# EAGLE design pinoccio-test (EAGLE 6.2)
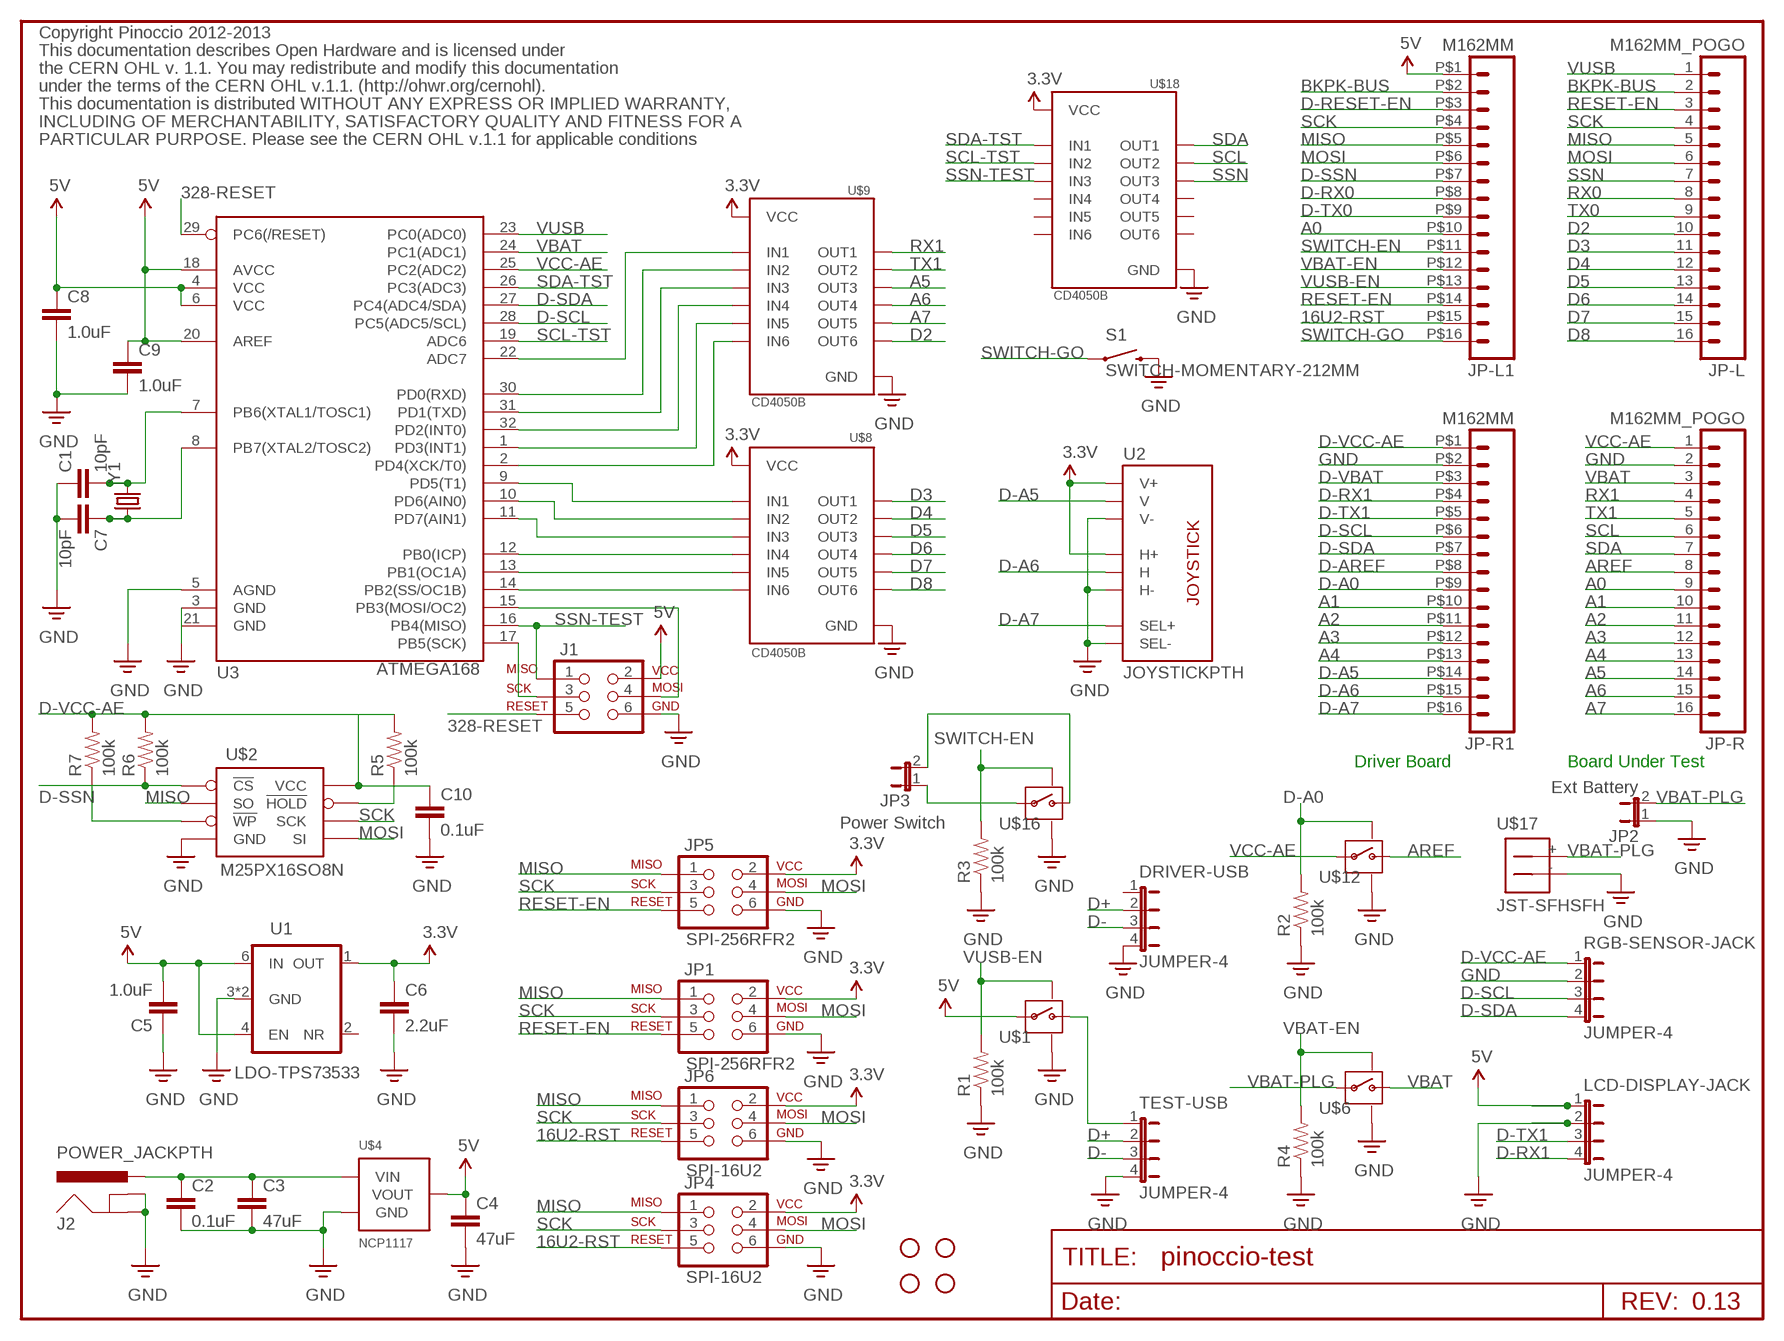
[diagram p0: schematic, sheet 1]

## Parts
C1  10pF  CAP0402-CAP  [0402-CAP]
C2  0.1uF  CAP0402-CAP  [0402-CAP]
C3  47uF  CAP0805  [0805]
C4  47uF  CAP0805  [0805]
C5  1.0uF  CAP0402-CAP  [0402-CAP]
C6  2.2uF  CAP0402-CAP  [0402-CAP]
C7  10pF  CAP0402-CAP  [0402-CAP]
C8  1.0uF  CAP0402-CAP  [0402-CAP]
C9  1.0uF  CAP0402-CAP  [0402-CAP]
C10  0.1uF  CAP0402-CAP  [0402-CAP]
DRIVER-USB  JUMPER-4  [1X04]
J1  SPI-328P  AVR_SPI_PRG_6PTH  [2X3]
J2  POWER_JACKPTH  [POWER_JACK_PTH]
JP1  SPI-256RFR2  AVR_SPI_PRG_6PTH  [2X3]
JP2  Ext Battery  JUMPER-2PTH  [1X02]
JP3  Power Switch  JUMPER-2PTH  [1X02]
JP4  SPI-16U2  AVR_SPI_PRG_6PTH  [2X3]
JP5  SPI-256RFR2  AVR_SPI_PRG_6PTH  [2X3]
JP6  SPI-16U2  AVR_SPI_PRG_6PTH  [2X3]
JP7  STAND-OFF  [STAND-OFF]
JP9  STAND-OFF  [STAND-OFF]
JP10  STAND-OFF  [STAND-OFF]
JP12  STAND-OFF  [STAND-OFF]
JP-L  M162MM_POGO  [1X16_2MM_POGO]
JP-L1  M162MM  [1X16_2MM]
JP-R  M162MM_POGO  [1X16_2MM_POGO]
JP-R1  M162MM  [1X16_2MM]
LCD-DISPLAY-JACK  JUMPER-4  [1X04]
R1  100k  RESISTOR0402-RES  [0402-RES]
R2  100k  RESISTOR0402-RES  [0402-RES]
R3  100k  RESISTOR0402-RES  [0402-RES]
R4  100k  RESISTOR0402-RES  [0402-RES]
R5  100k  RESISTOR0402-RES  [0402-RES]
R6  100k  RESISTOR0402-RES  [0402-RES]
R7  100k  RESISTOR0402-RES  [0402-RES]
RGB-SENSOR-JACK  JUMPER-4  [1X04]
S1  SWITCH-MOMENTARY-212MM  [TACTILE-PTH-12MM]
TEST-USB  JUMPER-4  [1X04]
U1  LDO-TPS73533  [SON-6-DRV]
U2  JOYSTICKPTH  [JOYSTICK]
U3  ATMEGA168  [TQFP32-08]
U$1  SWITCH-MOSFETTDFN4  [TDFN4]
U$2  M25PX16SO8N  [SO8N]
U$4  NCP1117  [SOT223]
U$6  SWITCH-MOSFETTDFN4  [TDFN4]
U$8  CD4050B  [TSSOP-16]
U$9  CD4050B  [TSSOP-16]
U$12  SWITCH-MOSFETTDFN4  [TDFN4]
U$16  SWITCH-MOSFETTDFN4  [TDFN4]
U$17  JST-SFHSFH  [JST-SFH]
U$18  CD4050B  [TSSOP-16]
Y1  CRYSTALABM10  [CRYSTAL-SMD-2.5X2-ABM10]

## Nets
3.3V: C6.1 JP1.2 JP4.2 JP5.2 JP6.2 U1.1(OUT) U2.H1(H+) U2.V1(V+) U$8.1(VCC) U$9.1(VCC) U$18.1(VCC)
5V: C4.1 C5.2 C8.1 C9.1 J1.2 JP-L1.P$1 LCD-DISPLAY-JACK.1 U1.4(EN) U1.6(IN) U3.4(VCC) U3.6(VCC) U3.18(AVCC) U3.20(AREF) U$1.P$3(IN) U$4.2(VOUT) U$4.4(VOUT)
16U2-RST: JP4.5 JP6.5 JP-L1.P$15
328-RESET: J1.5 U3.29(PC6(/RESET))
A0: JP-L1.P$10 JP-R.9
A1: JP-R1.P$10 JP-R.10
A2: JP-R1.P$11 JP-R.11
A3: JP-R1.P$12 JP-R.12
A4: JP-R1.P$13 JP-R.13
A5: JP-R.14 U$9.6(OUT3)
A6: JP-R.15 U$9.10(OUT4)
A7: JP-R.16 U$9.12(OUT5)
AREF: JP-R.8 U$12.P$1(OUT)
BKPK-BUS: JP-L1.P$2 JP-L.2
D2: JP-L.10 U$9.15(OUT6)
D3: JP-L.11 U$8.2(OUT1)
D4: JP-L.12 U$8.4(OUT2)
D5: JP-L.13 U$8.6(OUT3)
D6: JP-L.14 U$8.10(OUT4)
D7: JP-L.15 U$8.12(OUT5)
D8: JP-L.16 U$8.15(OUT6)
D+: DRIVER-USB.2 TEST-USB.2
D-: DRIVER-USB.3 TEST-USB.3
D-A0: JP-R1.P$9 R2.2 U$12.P$4(ON)
D-A5: JP-R1.P$14 U2.V2(V)
D-A6: JP-R1.P$15 U2.H2(H)
D-A7: JP-R1.P$16 U2.B1A(SEL+)
D-AREF: JP-R1.P$8
D-RESET-EN: JP-L1.P$3
D-RX0: JP-L1.P$8
D-RX1: JP-R1.P$4 LCD-DISPLAY-JACK.4
D-SCL: JP-R1.P$6 RGB-SENSOR-JACK.3 U3.28(PC5(ADC5/SCL))
D-SDA: JP-R1.P$7 RGB-SENSOR-JACK.4 U3.27(PC4(ADC4/SDA))
D-SSN: JP-L1.P$7 R6.1 U$2.1(!CS)
D-TX0: JP-L1.P$9
D-TX1: JP-R1.P$5 LCD-DISPLAY-JACK.3
D-VBAT: JP-R1.P$3
D-VCC-AE: C10.1 JP-R1.P$1 R5.2 R6.2 R7.2 RGB-SENSOR-JACK.1 U$2.8(VCC)
GND: C1.1 C2.2 C3.2 C4.2 C5.1 C6.2 C7.2 C8.2 C9.2 C10.2 DRIVER-USB.4 J1.6 J2.GND J2.GNDBREAK JP1.6 JP2.1 JP4.6 JP5.6 JP6.6 JP-R1.P$2 JP-R.2 LCD-DISPLAY-JACK.2 R1.1 R2.1 R3.1 R4.1 RGB-SENSOR-JACK.2 S1.3 TEST-USB.4 U1.3(GND) U1.PAD(GND) U2.B2A(SEL-) U2.H3(H-) U2.V3(V-) U3.3(GND) U3.5(AGND) U$1.P$2(GND) U$1.P$5(GND) U$2.4(GND) U$4.1(GND) U$6.P$2(GND) U$6.P$5(GND) U$8.8(GND) U$9.8(GND) U$12.P$2(GND) U$12.P$5(GND) U$16.P$2(GND) U$16.P$5(GND) U$17.- U$18.8(GND)
MISO: JP1.1 JP4.1 JP5.1 JP6.1 JP-L1.P$5 JP-L.5 U$2.2(SO)
MOSI: JP1.4 JP4.4 JP5.4 JP6.4 JP-L1.P$6 JP-L.6 U$2.5(SI)
N$1: U3.2(PD4(XCK/T0)) U$9.14(IN6)
N$2: U3.1(PD3(INT1)) U$9.11(IN5)
N$3: U3.14(PB2(SS/OC1B)) U$8.14(IN6)
N$4: C2.1 C3.1 J2.PWR U$4.3(VIN)
N$5: U3.32(PD2(INT0)) U$9.9(IN4)
N$6: C1.2 U3.7(PB6(XTAL1/TOSC1)) Y1.P$3
N$7: U3.31(PD1(TXD)) U$9.7(IN3)
N$8: U3.13(PB1(OC1A)) U$8.11(IN5)
N$9: U3.30(PD0(RXD)) U$9.5(IN2)
N$10: U3.22(ADC7) U$9.3(IN1)
N$11: U3.12(PB0(ICP)) U$8.9(IN4)
N$12: JP3.2 U$16.P$1(OUT)
N$13: U3.11(PD7(AIN1)) U$8.7(IN3)
N$14: C7.1 U3.8(PB7(XTAL2/TOSC2)) Y1.P$1
N$15: JP3.1 U$16.P$3(IN)
N$16: TEST-USB.1 U$1.P$1(OUT)
N$19: R7.1 U$2.3(!WP)
N$20: R5.1 U$2.7(!HOLD)
N$22: U3.10(PD6(AIN0)) U$8.5(IN2)
N$27: U3.9(PD5(T1)) U$8.3(IN1)
N$57: J1.4 U3.15(PB3(MOSI/OC2))
N$58: J1.3 U3.17(PB5(SCK))
RESET-EN: JP1.5 JP5.5 JP-L1.P$14 JP-L.3
RX0: JP-L.8
RX1: JP-R.4 U$9.2(OUT1)
SCK: JP1.3 JP4.3 JP5.3 JP6.3 JP-L1.P$4 JP-L.4 U$2.6(SCK)
SCL: JP-R.6 U$18.4(OUT2)
SCL-TST: U3.19(ADC6) U$18.5(IN2)
SDA: JP-R.7 U$18.2(OUT1)
SDA-TST: U3.26(PC3(ADC3)) U$18.3(IN1)
SSN: JP-L.7 U$18.6(OUT3)
SSN-TEST: J1.1 U3.16(PB4(MISO)) U$18.7(IN3)
SWITCH-EN: JP-L1.P$11 R3.2 U$16.P$4(ON)
SWITCH-GO: JP-L1.P$16 S1.1
TX0: JP-L.9
TX1: JP-R.5 U$9.4(OUT2)
VBAT: JP-R.3 U3.24(PC1(ADC1)) U$6.P$1(OUT)
VBAT-EN: JP-L1.P$12 R4.2 U$6.P$4(ON)
VBAT-PLG: JP2.2 U$6.P$3(IN) U$17.+
VCC-AE: JP-R.1 U3.25(PC2(ADC2)) U$12.P$3(IN)
VUSB: JP-L.1 U3.23(PC0(ADC0))
VUSB-EN: JP-L1.P$13 R1.2 U$1.P$4(ON)
Unconnected: DRIVER-USB.1 U1.2(NR) U1.5(N/C) U3.21(GND) U$18.9(IN4) U$18.10(OUT4) U$18.11(IN5) U$18.12(OUT5) U$18.14(IN6) U$18.15(OUT6)

## Notes on the sheet
- Copyright Pinoccio 2012-2013
- This documentation describes Open Hardware and is licensed under
- the CERN OHL v. 1.1. You may redistribute and modify this documentation
- under the terms of the CERN OHL v.1.1. (http://ohwr.org/cernohl).
- This documentation is distributed WITHOUT ANY EXPRESS OR IMPLIED WARRANTY,
- INCLUDING OF MERCHANTABILITY, SATISFACTORY QUALITY AND FITNESS FOR A
- PARTICULAR PURPOSE. Please see the CERN OHL v.1.1 for applicable conditions
- Driver Board | Board Under Test
- 0.13
- /Volumes/Data/Users/eric/Desktop/pinoccio.bmp
- /Volumes/Data/Users/eric/Desktop/pinoccio-1in.bmp | /Volumes/Data/Users/eric/Desktop/pinoccio-full-3-4in.bmp | /Volumes/Data/Users/eric/Desktop/pinoccio-full-3-4in.bmp

## Power pins joined to a net without a drawn wire
GND: Y1.P$2(GND) Y1.P$4(GND)

## Library data of the parts
C1-C10 = Pinoccio:CAP: Capacitor Standard 0603 ceramic capacitor, and 0.1" leaded capacitor.
DRIVER-USB LCD-DISPLAY-JACK RGB-SENSOR-JACK TEST-USB = Pinoccio:JUMPER-4
J1 JP1 JP4-JP6 = Pinoccio:AVR_SPI_PRG_6: AVR ISP 6 Pin This is the reduced ISP connector for AVR programming. Common on Arduino. This footprint will take up less PCB space and can be used with a 10-pin to 6-pin adapter such as SKU: BOB-08508
J2 = Pinoccio:POWER_JACK: Power Jack This is the standard 5.5mm barrel jack for power. The PTH is the most common, proven, reliable, footprint. All others are experimental. The Slot footprint only works if the mill layer is transmitted to the PCB fab house so be warned. Spark Fun Electronics SKU : PRT-00119. Mating wall wart : TOL-00298 (and others)
JP2 JP3 = Pinoccio:JUMPER-2: Jumper Basic 0.1" spaced jumper. Use with breakaway headers.
JP7 JP9 JP10 JP12 = Pinoccio:STAND-OFF: Stand Off This is the mechanical footprint for a #4 phillips button head screw. Use the keepout ring to avoid running the screw head into surrounding components. SKU : PRT-00447
JP-L JP-L1 JP-R JP-R1 = Pinoccio:M16
R1-R7 = Pinoccio:RESISTOR: Resistor Basic schematic elements and footprints for 0603, 1206, and PTH resistors.
S1 = Pinoccio:SWITCH-MOMENTARY-2
U1 = Pinoccio:LDO-TPS73533: Voltage Regulator LDO 500mA, Low Quiescent Current, Ultra-LowNoise, High PSRR Low-Dropout Linear Regulator
U2 = Pinoccio:JOYSTICK: Thumb Joystick Joystick commonly found in PS2 controllers. Two pots and a select switch. Footprint proven. Spark Fun Electronics SKU : COM-09032
U3 = SparkFun:ATMEGA168
U$1 U$6 U$12 U$16 = Pinoccio:SWITCH-MOSFET
U$2 = Pinoccio:M25PX16
U$4 = Pinoccio:NCP1117: NCP1117 LDO Regulator
U$8 U$9 U$18 = Pinoccio:CD4050B
U$17 = Pinoccio:JST-SFH
Y1 = Pinoccio:CRYSTAL: Crystals Various standard crystals. Proven footprints. Spark Fun Electronics SKU : COM-00534

## Net classes
0 Default: width 0.203 mm
1 VCC: width 0.305 mm
2 LEDPower: width 0.203 mm
3 ButtonSignal: width 0.203 mm
4 RF Antenna: width 0.305 mm
5 GND: width 0.203 mm

## Board
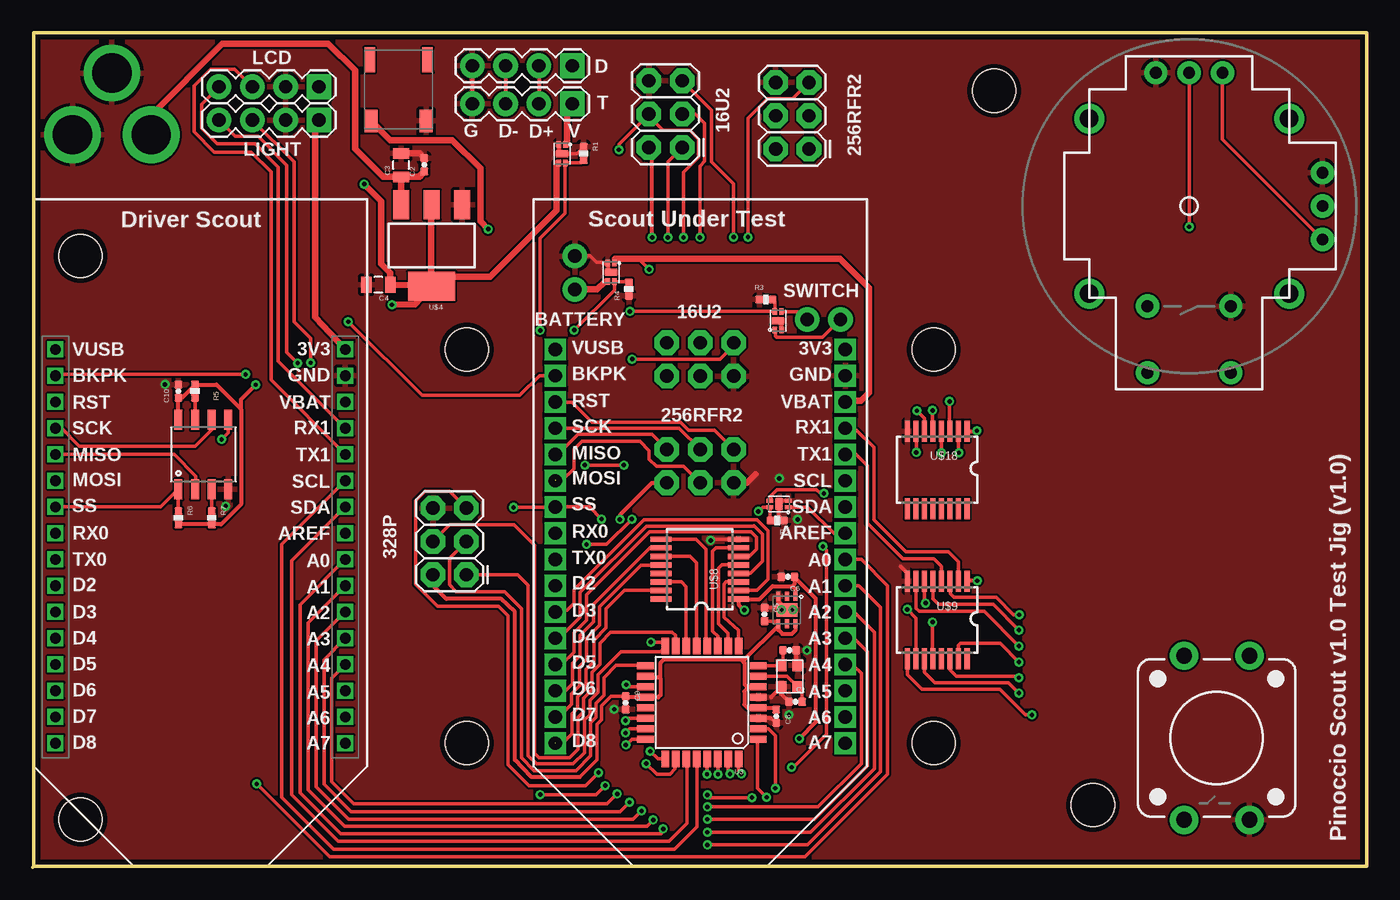
[diagram p1: board, top side]
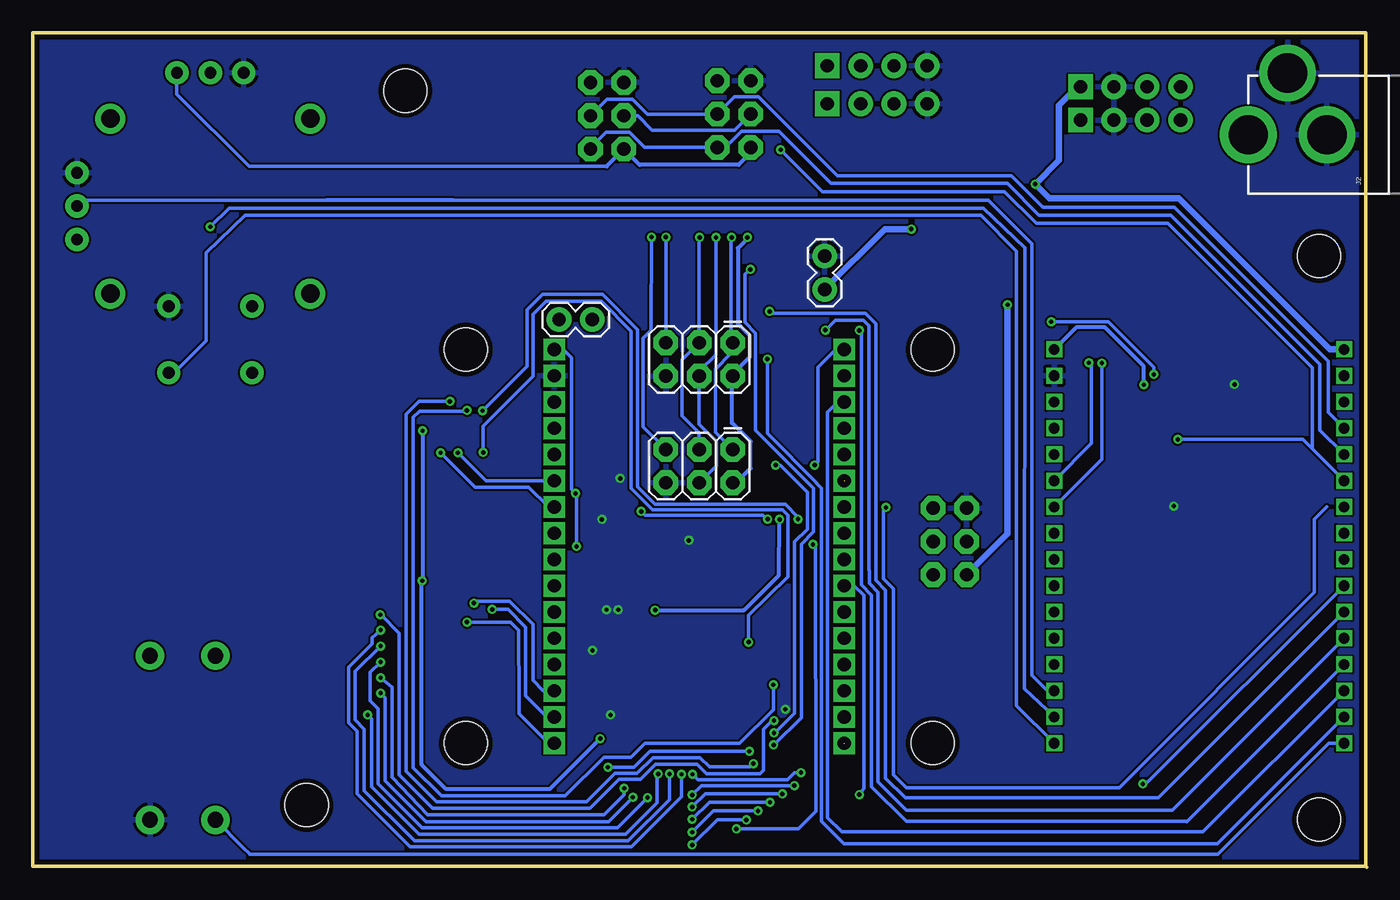
[diagram p2: board, bottom side, seen from below]

Size 101.68 x 63.58 mm. Coordinates in mm from the lower left corner, seen from the top.
Outline: 0,0 0.08,0.08
Outline: 0.08,0.08 101.68,0.08 101.68,63.58 0.08,63.58 0.08,0.08
Copper layers (1*16): Top 0.0356mm / dielectric 1.5011mm / Bottom 0.0356mm
Design rules: minimum track width 6mil, minimum drill 13mil, track to track 6mil, track to pad 6mil, pad to pad 6mil, via to via 6mil, smd to smd 6mil, copper to edge 15mil, drill to drill 6mil, minimum pad ring 7mil, minimum via ring 7mil, stop-mask expansion 4mil, vias tented up to drill 16mil, thermal gap 10mil

### Footprints (pad centres in the part's own frame; a part is rotated, then mirrored left to right if it is on the bottom)
0402-CAP = smd 0.6 x 0.6: 1 -0.5,0; 2 0.5,0
0805 = smd 0.8 x 1.2: 1 -0.9,0; 2 0.9,0
1X04 = drill 1.016 pad 1.88 square: 1 0,0 | drill 1.016 pad 1.88: 2 2.54,0; 3 5.08,0; 4 7.62,0
2X3 = drill 1.016 pad 1.88 octagon: 1 0,0; 2 0,2.54; 3 2.54,0; 4 2.54,2.54; 5 5.08,0; 6 5.08,2.54
POWER_JACK_PTH = drill 2.997 pad 4.318: GND 0,7.7; GNDBREAK 4.7,10.7; PWR 0,13.7
1X02 = drill 1.016 pad 1.88: 1 0,0; 2 2.54,0
STAND-OFF = hole 3.302: 0,0
1X16_2MM_POGO = drill 1.016 pad 1.651 square: 1 0,0; 2 2,0; 3 4,0; 4 6,0; 5 8,0; 6 10,0; 7 12,0; 8 14,0; 9 16,0; 10 18,0; 11 20,0; 12 22,0; 13 24,0; 14 26,0; 15 28,0; 16 30,0
1X16_2MM = drill 0.813 square: P$1 0,0; P$2 2,0; P$3 4,0; P$4 6,0; P$5 8,0; P$6 10,0; P$7 12,0; P$8 14,0; P$9 16,0; P$10 18,0; P$11 20,0; P$12 22,0; P$13 24,0; P$14 26,0; P$15 28,0; P$16 30,0
0402-RES = smd 0.6 x 0.6: 1 -0.5,0; 2 0.5,0
TACTILE-PTH-12MM = drill 1.2 pad 2.159: 1 6.25,-2.5; 2 -6.25,-2.5; 3 6.25,2.5; 4 -6.25,2.5
SON-6-DRV = smd 0.3 x 0.7: 1 0.4,0; 2 1.05,0; 3 1.7,0; 4 1.7,2.1; 5 1.05,2.1; 6 0.4,2.1 | smd 1.6 x 1: PAD 1.05,1.05
JOYSTICK = drill 0.9 pad 1.778: B1A -3.175,12.7; B1B 3.175,12.7; B2A -3.175,7.62; B2B 3.175,7.62 | drill 0.889 pad 1.778: H1 -2.54,-10.16; H2 0,-10.16; H3 2.54,-10.16; V1 -10.16,2.54; V2 -10.16,0; V3 -10.16,-2.54 | drill 1.397 pad 2.286: MOUNT1 -7.62,6.668; MOUNT2 -7.62,-6.668; MOUNT3 7.62,-6.668; MOUNT4 7.62,6.668
TQFP32-08 = smd 1.27 x 0.559: 1 -4.293,2.8; 2 -4.293,2; 3 -4.293,1.2; 4 -4.293,0.4; 5 -4.293,-0.4; 6 -4.293,-1.2; 7 -4.293,-2; 8 -4.293,-2.8; 17 4.293,-2.8; 18 4.293,-2; 19 4.293,-1.2; 20 4.293,-0.4; 21 4.293,0.4; 22 4.293,1.2; 23 4.293,2; 24 4.293,2.8 | smd 0.559 x 1.27: 9 -2.8,-4.293; 10 -2,-4.293; 11 -1.2,-4.293; 12 -0.4,-4.293; 13 0.4,-4.293; 14 1.2,-4.293; 15 2,-4.293; 16 2.8,-4.293; 25 2.8,4.293; 26 2,4.293; 27 1.2,4.293; 28 0.4,4.293; 29 -0.4,4.293; 30 -1.2,4.293; 31 -2,4.293; 32 -2.8,4.293
TDFN4 = smd 0.325 x 0.5: P$1 0.35,0.1; P$2 0.85,0.1; P$3 0.85,1.5; P$4 0.35,1.5 | smd 0.9 x 0.55: P$5 0.6,0.8
SO8N = smd 0.61 x 1.524: 1 -1.905,-2.678; 2 -0.635,-2.678; 3 0.635,-2.678; 4 1.905,-2.678; 5 1.905,2.621; 6 0.635,2.621; 7 -0.635,2.621; 8 -1.905,2.621
SOT223 = smd 1.219 x 2.235: 1 -2.311,-3.099; 2 0,-3.099; 3 2.311,-3.099 | smd 3.6 x 2.2: 4 0,3.099
TSSOP-16 = smd 0.4 x 1.6: 1 -2.225,-2.85; 2 -1.575,-2.85; 3 -0.925,-2.85; 4 -0.275,-2.85; 5 0.375,-2.85; 6 1.025,-2.85; 7 1.675,-2.85; 8 2.325,-2.85; 9 2.325,3.05; 10 1.675,3.05; 11 1.025,3.05; 12 0.375,3.05; 13 -0.275,3.05; 14 -0.925,3.05; 15 -1.575,3.05; 16 -2.225,3.05
JST-SFH = smd 1 x 1.7: + 4.7,5.6; - 0.5,5.6 | smd 0.8 x 1.9: P$1 0.4,0.95; P$2 4.8,0.95
CRYSTAL-SMD-2.5X2-ABM10 = smd 0.9 x 0.8: P$1 -0.85,-0.65; P$2 0.8,-0.65; P$3 0.8,0.6; P$4 -0.85,0.6

### Placement (x,y rotation side)
C1  58.14,12.6 0 top
C2  29.84,53.52 90 top
C3  28.07,53.49 90 top
C4  26.34,44.37 180 top
C5  55.78,19.25 270 top
C6  57.56,22.12 180 top
C7  57.68,16.54 0 top
C8  56.67,11.51 270 top
C9  45.19,12.52 270 top
C10  11.1,36.27 90 top
DRIVER-USB  41.12,61.06 180 top
J1  33.05,22.28 90 top
J2  -4.67,55.8 90 bottom
JP1  48.34,31.83 180 bottom
JP2  41.33,46.56 270 bottom
JP3  59.02,41.73 180 bottom
JP4  48.34,39.95 180 bottom
JP5  59.16,54.71 90 top
JP6  49.5,54.84 90 top
JP7  68.66,39.45 0 top
JP8  STAND-OFF  [STAND-OFF]  33.1,39.45 0 top
JP9  33.1,9.45 0 top
JP10  68.66,9.45 0 top
JP11  STAND-OFF  [STAND-OFF]  3.63,46.56 0 top
JP12  3.63,3.63 0 top
JP13  STAND-OFF  [STAND-OFF]  73.28,59.16 0 top
JP14  STAND-OFF  [STAND-OFF]  80.8,4.72 0 top
JP-L  39.83,39.45 270 top
JP-L1  1.73,39.45 270 top
JP-R  61.93,39.45 270 top
JP-R1  23.83,39.45 270 top
LCD-DISPLAY-JACK  21.82,59.46 180 top
R1  41.99,54.38 270 top
R2  56.74,26.42 180 top
R3  55.88,43.26 0 top
R4  45.44,44.04 90 top
R5  12.37,36.27 90 top
R6  11.1,26.62 270 top
R7  13.64,26.62 270 top
RGB-SENSOR-JACK  21.82,56.92 180 top
S1  90.25,9.86 270 top
TEST-USB  41.12,58.17 180 top
U1  58.52,20.65 180 top
U2  88.14,50.37 180 top
U3  51,12.55 180 top
U$1  40.94,55.17 180 top
U$2  13,31.47 0 top
U$4  30.4,47.37 180 top
U$6  44.68,46.13 180 top
U$8  50.95,22.66 90 top
U$9  68.99,18.92 180 top
U$12  57.68,27.08 90 top
U$16  56.21,40.84 0 top
U$17  30.48,62.46 180 top
U$18  68.99,30.38 180 top
Y1  57.71,14.53 270 top

### Tracks (layer width: path | path; a pad name or v marks a point on that pad's centre or on a via)
3.3V  (via drill 0.33)
  Top 0.254: U2.V1 90.68,55.45 U2.H1
  Top 0.305: 57.91,21.41 56.39,21.41 55.41,20.43 U$8.1 53.8,20.01 v54.23,19.58 | 57.91,21.41 58.14,21.18 58.14,20.67 U1.1 | 57.91,21.41 58.06,21.56 C6.1 58.06,22.08 59.66,20.47 59.66,11.05 v58.42,9.8 | v47.22,47.98 47.22,54.58 JP6.2 | v71.98,21.82 71.26,21.82 U$9.1 | U$18.1 71.94,33.23 v71.96,33.25 | v44.76,26.49 44.81,26.9 47.19,29.29 JP1.2
  Bottom 0.254: 57.94,53.39 85.19,53.39 90.7,58.9 90.7,60.5 U2.H1
  Bottom 0.305: v54.23,19.58 47.47,19.58 44.81,22.25 v44.76,26.49 | JP1.2 48.06,29.29 46.96,30.38 46.96,32.44 48.39,33.86 48.39,37.36 JP4.2 48.34,37.57 47.04,38.86 47.04,40.51 47.93,41.4 47.93,47.17 47.45,47.65 v47.22,47.98 | JP6.2 46.96,54.43 47.88,53.52 55.42,53.52 JP5.2 57.94,53.39 | v58.42,9.8 62.28,5.94 70.16,5.94 72.03,7.82 72.03,21.77 v71.98,21.82 71.96,21.84 v71.96,33.25
5V  (via drill 0.33)
  Top 0.254: 56.76,12.15 C8.1 | 45.21,12.95 C9.1 44.06,13.02 43.36,12.32 43.36,11.23 43.03,10.9 43.03,8.2 41.68,6.86 | C5.2 56.62,18.75 U1.4
  Top 0.305: 30.47,44.34 U$4.4 | 30.59,44.97 30.4,44.78 | 56.76,12.15 U3.4 54.48,12.14 54.23,12.4 54.23,13.39 54.53,13.69 55.35,13.69 U3.6 54.43,13.75 54.25,13.92 54.25,15.55 53.98,15.82 | 45.21,12.95 U3.20 47.67,12.95 47.85,13.13 47.85,14.35 | U3.18 46.78,14.48 47.73,14.48 47.85,14.35 | 47.85,14.35 47.85,15.57 48.11,15.82 53.98,15.82 | 53.98,15.82 54.25,15.82 56.82,18.39 U1.4 56.82,18.08 57.12,17.78 57.86,17.78 58.12,18.04 U1.6 | U$1.P$3 39.93,53.66 | 41.68,6.86 38.02,6.86 36.75,8.18 36.75,19.46 35.71,20.45 31.52,20.45 30.53,21.44 30.53,22.25 J1.2
  Top 0.508: U$4.4 30.32,44.36 C4.1 27.24,45.3 26.57,45.97 26.57,50.75 v25.27,52.04 | U$4.2 30.38,50.44 30.38,44.81 30.4,44.78 U$4.4 | 30.59,44.97 34.86,44.97 39.93,50.04 39.93,53.66 | U$4.4 29.16,42.88 v27.38,42.85
  Bottom 0.508: JP-L1.P$1 2.82,39.45 2.82,39.47 14.33,50.98 24.21,50.98 v25.27,52.04 23.47,53.85 23.47,58.06 22.07,59.46 LCD-DISPLAY-JACK.1 | v27.38,42.85 27.38,25.4 J1.2
16U2-RST  (via drill 0.33)
  Top 0.254: v53.42,48.01 53.42,52.07 51.74,53.75 51.74,57.68 JP6.5 | v45.69,38.71 52.38,38.71 53.42,39.75 JP4.5
  Bottom 0.254: JP-L1.P$15 11.37,1.8 39.85,1.8 41.55,3.51 41.55,28.88 41.94,29.26 41.94,29.29 45.69,33.05 v45.69,38.71 | JP4.5 v53.42,48.01
328-RESET  (via drill 0.33)
  Top 0.254: U3.29 51.38,8.24 v51.38,7.09 | v43.13,7.21 42.14,6.22 37.85,6.22 36.22,7.82 36.22,19.15 35.51,19.89 30.86,19.89 29.18,21.56 29.18,27.91 29.9,28.63 31.78,28.63 J1.5
  Bottom 0.254: v51.38,7.09 50.98,6.68 44.17,6.68 43.64,7.21 v43.13,7.21
A0  (via drill 0.33)
  Top 0.254: v17.07,6.35 22.63,0.79 58.85,0.79 65.15,7.09 65.15,21.44 63.14,23.44 JP-R.9
  Bottom 0.254: JP-L1.P$10 16.82,6.35 v17.07,6.35
A1  (via drill 0.33)
  Top 0.254: JP-R1.P$10 21.01,18.63 21.01,5.89 23.77,3.12 46.84,3.12 v47.3,3.61 | v51.41,1.7 59.06,1.7 64.62,7.26 64.62,19.79 62.96,21.45 JP-R.10
  Bottom 0.254: v47.3,3.61 49.5,3.61 v51.41,1.7
A2  (via drill 0.33)
  Top 0.254: JP-R1.P$11 21.62,17.24 21.62,6.12 24.08,3.66 45.77,3.66 v46.41,4.29 | v51.41,2.67 59.28,2.67 64.14,7.52 64.14,17.91 62.6,19.45 JP-R.11
  Bottom 0.254: v46.41,4.29 49.78,4.29 v51.41,2.67
A3  (via drill 0.33)
  Top 0.254: JP-R1.P$12 22.2,15.82 22.2,6.32 24.28,4.24 44.76,4.24 v45.49,4.95 | v51.41,3.66 59.56,3.66 63.63,7.72 63.63,16.41 62.59,17.45 JP-R.12
  Bottom 0.254: v45.49,4.95 50.11,4.95 v51.41,3.66
A4  (via drill 0.33)
  Top 0.254: JP-R1.P$13 22.78,14.41 22.78,6.53 24.46,4.85 43.79,4.85 v44.55,5.59 | v51.41,4.6 59.84,4.6 63.14,7.9 63.14,14.76 62.46,15.45 JP-R.13
  Bottom 0.254: v44.55,5.59 50.42,5.59 v51.41,4.6
A5  (via drill 0.33)
  Top 0.254: U$9.6 67.96,20.39 v68.05,20.12
  Bottom 0.254: JP-R.14 62.77,13.45 63.55,14.22 63.55,18.49 65.33,20.27 67.87,20.27 v68.05,20.12
A6  (via drill 0.33)
  Top 0.254: U$9.10 67.31,18.97 v66.65,19.63
  Bottom 0.254: v66.65,19.63 65.46,19.63 64.11,18.29 64.11,13.06 62.5,11.45 JP-R.15
A7  (via drill 0.33)
  Top 0.254: v68.58,18.67 68.58,15.9 U$9.12
  Bottom 0.254: JP-R.16 62.03,9.55 62.46,9.55 | 62.46,9.55 62.61,9.55 | v68.58,18.67 68.48,18.64 65.25,18.64 64.64,18.03 64.62,12.65 64.62,11.71 62.46,9.55
AREF
  Top 0.254: U$12.P$1 59.06,27.43 61.06,25.43 61.9,25.43 JP-R.8
BKPK-BUS  (via drill 0.33)
  Top 0.254: JP-L1.P$2 1.82,37.54 v16.23,37.54 | v24.05,41.55 29.67,35.94 37.11,35.94 38.61,37.45 JP-L.2
  Bottom 0.254: v16.23,37.54 16.23,38.07 19.71,41.55 v24.05,41.55
D2  (via drill 0.33)
  Top 0.254: v38.68,5.54 42.95,5.54 v43.64,6.22 | v51.41,5.51 51.61,5.31 v54.81,5.31 | v75.16,15.62 73.74,17.04 70.69,17.04 70.56,16.92 U$9.15
  Bottom 0.254: v43.64,6.22 50.7,6.22 v51.41,5.51 | JP-L.10 39.1,21.45 38.33,20.7 38.33,6.02 v38.68,5.54 | v75.16,15.62 75.97,14.83 75.97,12.7 75.34,12.07 75.34,6.35 72.01,3.02 57.1,3.02 v54.81,5.31
D3
  Top 0.254: U$8.2 53.83,21.11 55.19,21.11 56.03,21.95 56.03,25.63 55.19,26.47 46.61,26.47 41.28,21.13 41.28,20.09 40.74,19.56 39.94,19.56 JP-L.11
D4
  Top 0.254: U$8.4 54.71,22.38 55.63,23.29 55.63,25.35 54.97,26.01 54.94,25.98 46.79,25.98 41.73,20.93 41.73,19.05 40.13,17.45 JP-L.12
D5
  Top 0.254: 53.79,23.67 U$8.6 53.81,23.67 54.64,23.67 55.17,24.21 55.17,25.12 54.74,25.55 47.02,25.55 42.22,20.75 42.22,18.82 41.25,17.86 41.25,16.38 40.31,15.45 JP-L.13
D6
  Top 0.254: U$8.10 47.04,24.33 46.62,23.91 46.25,23.55 42.75,20.04 42.75,18.69 41.73,17.68 41.73,16.1 41.15,15.52 41.15,13.97 40.62,13.45 JP-L.14
D7
  Top 0.254: U$8.12 47.88,23.01 46.38,23.01 43.21,19.84 43.21,18.44 42.22,17.45 42.22,15.85 41.68,15.32 41.68,13.82 41.07,13.21 41.07,12.42 40.1,11.45 JP-L.15
D8  (1 unrouted)
  Top 0.254: U$8.15 46.23,21.08 45.11,21.08 43.71,19.69 43.71,18.24 42.77,17.3 42.77,15.67 42.19,15.09 42.19,13.64 41.53,12.98 41.53,12.12 41.12,11.71 41.12,10.19 40.39,9.45 JP-L.16
D+
  Top 0.305: DRIVER-USB.2 TEST-USB.2
D-
  Top 0.305: DRIVER-USB.3 TEST-USB.3
D-A0  (via drill 0.33)
  Top 0.254: JP-R1.P$9 20.37,19.99 20.37,5.66 23.47,2.57 47.88,2.57 48.06,2.74 v48.06,2.92 | v55.3,27.1 55.65,27.43 U$12.P$4 56.18,26.48 R2.2 | v42.22,24.59 43.74,24.59 v45.67,26.52
  Bottom 0.254: v48.06,2.92 43.33,2.92 41.99,4.27 42.01,24.41 42.19,24.59 v42.22,24.59 | v55.3,27.1 55.02,26.82 46.03,26.82 v45.67,26.52
D-A5
  Bottom 0.254: 69.65,50.83 28.85,50.83 25.53,47.5 25.53,14.63 24.34,13.45 JP-R1.P$14 | 79.25,50.83 97.84,50.83 U2.V2
  Bottom 0.305: 69.65,50.83 79.25,50.83
D-A6  (via drill 0.33)
  Top 0.254: v88.14,48.79 U2.H2
  Bottom 0.254: JP-R1.P$15 26.11,13.61 26.06,47.19 29.21,50.22 86.72,50.22 v88.14,48.79
D-A7
  Bottom 0.254: JP-R1.P$16 26.7,12.32 26.7,46.94 29.41,49.66 85.5,49.68 88.47,46.81 88.47,40.11 90.91,37.67 U2.B1A
D-RX1
  Top 0.254: JP-R1.P$4 18.72,38.55 18.72,53.34 16.94,55.12 14.05,55.12 12.88,56.29 12.88,58.14 LCD-DISPLAY-JACK.4
D-SCL  (via drill 0.33)
  Top 0.254: JP-R1.P$6 18.97,24.6 18.97,5.33 22.94,1.37 48.92,1.37 50.62,3.1 50.62,8.24 U3.28 | v21.18,38.43 21.18,40.31 19.91,41.55 19.91,53.75 RGB-SENSOR-JACK.3
  Bottom 0.254: v21.18,38.43 20.98,38.43 20.98,32.29 JP-R1.P$6
D-SDA  (via drill 0.33)
  Top 0.254: JP-R1.P$7 19.74,23.36 19.74,5.51 23.27,1.98 48.51,1.98 49.86,3.35 49.86,8.2 U3.27 | v20.19,38.41 19.36,39.24 19.36,53.49 17.17,55.68 15.44,55.68 RGB-SENSOR-JACK.4
  Bottom 0.254: v20.19,38.41 20.19,31.08 JP-R1.P$7
D-SSN
  Top 0.254: R6.1 U$2.1 9.75,27.45 JP-L1.P$7
D-TX1
  Top 0.254: JP-R1.P$5 18.16,37.14 18.16,52.98 16.66,54.48 13.84,54.48 12.29,56.03 12.29,59.54 13.56,60.81 15.39,60.81 LCD-DISPLAY-JACK.3
D-VCC-AE  (via drill 0.33)
  Top 0.254: 13.67,26.09 13.65,26.11
  Top 0.305: U$2.8 C10.1 11.37,35.77 R5.2 14,36.77 15.88,34.9 | 15.88,34.9 15.88,27.64 14.35,26.11 13.65,26.11 | 13.65,26.11 R7.2 | 13.65,26.11 11.11,26.11 R6.2 | 15.88,34.9 15.88,35.64 v16.99,36.75
  Top 0.508: JP-R1.P$1 21.51,41.91 21.51,56.62 RGB-SENSOR-JACK.1
  Bottom 0.305: v16.99,36.75 16.99,38.15 19.96,41.12 22.15,41.12 JP-R1.P$1
GND  (via drill 0.33)
  Top 0.254: 56.24,11.34 C8.2 | U$16.P$2 57.06,41.39 U$16.P$5 | U$8.8 51.73,24.98 v51.66,24.89 | C5.1 57.32,19.75 U1.PAD | U$6.P$5 43.83,45.58 U$6.P$2 43.64,46.03 43.43,46.03 43.36,46.1 42.98,46.1 42.49,46.58 41.35,46.58 JP2.1 | U$1.P$2 40.1,54.62 U$1.P$5 41.47,54.37 R1.1 | U$12.P$2 57.13,27.93 U$12.P$5 56.88,26.78 R2.1
  Top 0.305: DRIVER-USB.4 TEST-USB.4 | 56.28,12.95 Y1.P$2 57.06,13.18 C1.1 | 56.24,11.34 U3.3 | C7.2 58.18,15.5 Y1.P$4 | U1.3 56.82,20.25 U1.PAD | U$9.8 66.66,22.39 66.14,22.91
  Top 0.508: C3.2 29.47,54.39 C2.2 | JP1.6 54.43,29.29 55.09,29.95
  other vias: 58.29,26.49 57.94,19.61 57.05,19.61 57.63,11.61 59,16.51 44.32,12.04 14.71,27.51 10.08,36.78 56.9,29.62
  pour Bottom: 0.2,63.4 101.47,63.4 101.47,0.3 0.2,0.3 0.2,63.22
  pour Top: 0.25,63.45 101.55,63.45 101.55,0.3 0.3,0.3 0.3,63.35
MISO  (via drill 0.33)
  Top 0.254: v48.41,47.98 48.41,53.75 JP6.1 | JP-L1.P$5 10.77,31.45 12.42,29.79 12.42,28.84 U$2.2 | JP-L.5 40.03,31.45 41.55,32.97 47.19,32.97 JP1.1
  Bottom 0.254: 59.18,54.69 JP5.1 59.16,54.81 57.96,56.01 56.19,56.01 55.04,54.86 49.53,54.86 JP6.1 48.87,54.84 47.65,56.06 44.83,56.06 | JP4.1 48.46,39.95 | JP1.1 49.66,33.15 49.66,37.95 48.46,39.14 48.46,39.95 | 48.46,39.95 48.46,47.93 v48.41,47.98 | 44.83,56.06 44.81,56.03 44.78,56.03 40.84,52.1 27.41,52.1 24.99,49.68 14.94,49.68 3.58,38.33 3.58,33.3 JP-L1.P$5 | 44.83,56.06 44.81,56.06
MOSI  (via drill 0.33)  (1 unrouted)
  Top 0.254: JP1.4 49.61,30.56 47.55,30.56 46.99,31.09 46.99,31.72 46.28,32.44 41.86,32.44 41.25,31.83 41.25,30.35 40.36,29.46 39.85,29.46 | v44.68,54.66 44.68,55.09 JP6.4 | 46.96,57.2 48.03,56.13 50.09,56.13 50.75,55.47 50.75,54.1 49.61,52.96 v49.61,47.98 | U$2.5 14.91,33.1 v14.4,32.59
  Top 0.305: 46.96,57.2 JP6.4
  Bottom 0.254: JP1.4 49.58,30.58 49.58,32.46 50.88,33.76 JP4.4 50.88,37.77 49.61,39.04 v49.61,47.98 | v44.68,54.66 41.48,51.46 27.61,51.46 25.2,49.05 15.16,49.05 4.17,38.05 4.17,31.88 | JP5.4 55.55,57.25 54.48,56.13 48.18,56.13 JP6.4 | 4.17,31.88 JP-L1.P$6 | v14.4,32.59 4.87,32.59 4.17,31.88
N$1  (via drill 0.33)
  Top 0.254: U3.2 56.08,10.55 56.59,10.03 v56.59,6.02 | v75.16,14.43 75.06,14.53 70.41,14.53 69.91,15.03 U$9.14
  Bottom 0.254: v56.59,6.02 56.59,5.54 58.12,4.01 71.58,4.01 74.3,6.86 74.3,13.72 v75.16,14.43
N$2  (via drill 0.33)
  Top 0.254: U3.1 55.25,9.7 55.25,6.02 v55.93,5.33 | v75.16,13.26 74.37,14.05 68.76,14.05 67.96,14.84 U$9.11
  Bottom 0.254: v75.16,13.26 74.8,12.9 74.8,6.6 71.68,3.48 57.79,3.48 v55.93,5.33
N$3
  Top 0.254: U$8.14 49.44,21.73 49.81,21.36 U3.14
N$4
  Top 0.508: 28.07,50.47 U$4.3 28.01,50.56 28.09,50.64 C3.1 | 27.95,52.75 C3.1 | C3.1 29.47,52.62 C2.1 | J2.PWR 9.03,57.31 14.45,62.74 22.53,62.74 24.56,60.71 24.56,54.74 26.71,52.59 C3.1
N$5  (via drill 0.33)
  Top 0.254: U3.32 53.8,7.31 v54,7.11 | U$9.9 66.66,14.64 67.77,13.54 73.71,13.54 75.64,11.61 v76.15,11.61
  Bottom 0.254: v76.15,11.61 75.84,11.3 75.84,6.12 72.24,2.51 56.49,2.51 54.08,4.93 54.08,7.04 v54,7.11
N$6
  Top 0.254: U3.7 57.49,14.55 Y1.P$3 58.64,13.51 C1.2
N$7  (via drill 0.33)
  Top 0.254: U3.31 53,7.37 v53.14,7.11 | v75.16,16.84 72.52,19.48 67.56,19.48 67.31,19.73 U$9.7
  Bottom 0.254: v75.16,16.84 77.11,14.91 77.11,11.23 76.4,10.52 76.4,5.84 72.76,2.2 72.57,2.01 56.29,2.01 53.14,5.16 v53.14,7.11
N$8
  Top 0.254: U$8.11 50.11,23.68 50.6,23.19 U3.13
N$9  (via drill 0.33)
  Top 0.254: U3.30 52.22,8.24 v52.22,7.09 | v75.16,18.06 73.2,20.02 69.04,20.02 68.61,20.44 U$9.5
  Bottom 0.254: v75.16,18.06 75.82,17.48 75.82,17.02 77.6,15.24 77.6,11 76.96,10.36 76.96,5.61 73.08,1.73 72.9,1.55 56.03,1.55 52.22,5.36 v52.22,7.09
N$10  (via drill 0.33)
  Top 0.254: U3.22 45.36,11.35 v45.19,11.18 | U$9.3 69.93,21.76 69.93,20.83 70.21,20.55 73.43,20.55 74.75,19.23 v75.18,19.23
  Bottom 0.254: v45.19,11.18 45.34,11.18 46,10.52 46,7.39 46.25,7.14 50.34,7.14 51.05,7.85 54.2,7.85 55.35,6.71 56.97,6.71 59.18,4.5 71.2,4.5 73.74,7.04 73.74,17.83 75.13,19.23 v75.18,19.23
N$11
  Top 0.254: U$8.9 50.56,24.98 51.31,24.23 51.31,16.84 U3.12
N$12
  Top 0.254: U$16.P$1 56.59,40.46 56.69,40.36 60.19,40.36 JP3.2
N$13
  Top 0.254: U$8.7 52.09,24.33 51.82,24.05 51.82,17.98 52.22,17.58 52.22,16.86 U3.11
N$14
  Top 0.254: U3.8 56.7,15.35 Y1.P$1 57.18,15.55 C7.1
N$15
  Top 0.254: U$16.P$3 57.09,42.32 58.47,42.32 59.02,41.77 JP3.1
N$16
  Top 0.305: U$1.P$1 40.72,55.06
  Top 0.508: 40.72,55.06 40.72,57.48 41.12,57.94 TEST-USB.1
N$19
  Top 0.254: U$2.3 R7.1
N$20
  Top 0.254: R5.1 U$2.7
N$22
  Top 0.254: U$8.5 52.52,23.03 52.25,22.76 52.25,18.54 52.98,17.81 52.98,16.86 U3.10
N$27
  Top 0.254: U$8.3 52.85,21.73 52.68,21.56 52.68,19.05 53.8,18.03 U3.9
N$57
  Top 0.254: J1.4 31.78,26.09 36.68,26.09 38.25,24.51 38.25,8.69 38.61,8.33 40.92,8.33 41.58,8.99 41.58,11.43 41.99,11.84 41.99,12.85 42.65,13.51 42.65,14.86 43.23,15.44 43.23,17.04 44.04,17.88 44.07,17.91 48.74,17.91 49,17.65 49,16.85 U3.15
N$58
  Top 0.254: J1.3 31.78,23.55 31.78,21.51 32.28,20.98 35.97,20.98 37.26,19.69 37.26,8.33 38.23,7.37 41.4,7.37 42.52,8.48 42.52,11.02 42.93,11.43 42.93,12.5 43.54,13.11 43.54,14.43 44.48,15.37 46.69,15.37 U3.17
RESET-EN  (via drill 0.33)
  Top 0.254: v54.51,48.01 54.51,57.05 56.01,58.55 57.91,58.55 JP5.5 | JP-L.3 39.84,35.43 41.12,35.43 42.65,33.91 49.38,33.91 49.99,33.3 51.94,33.3 JP1.5
  Bottom 0.254: JP-L1.P$14 12.48,2.69 40.01,2.69 41.1,3.78 41.1,34.65 40.3,35.45 JP-L.3 39.84,35.43 40.36,35.43 | 53.29,31.83 JP1.5 55.14,33.55 55.14,40.28 54.53,40.89 v54.51,48.01
RX1
  Top 0.254: U$9.2 70.56,23.27 69.8,24.03 66.55,24.03 64.11,26.47 64.11,31.98 62.79,33.3 62.07,33.3 JP-R.4
SCK  (via drill 0.33)
  Top 0.254: JP-L.4 49.26,33.45 JP1.3 | v50.85,47.98 50.85,53.42 51.21,53.77 51.21,56.69 50.52,57.38 JP6.3 | JP-L1.P$4 2.19,33.45 3.56,32.08 12.4,32.08 13.74,33.43 13.74,33.99 U$2.6
  Bottom 0.254: JP1.3 50.88,33.1 52.17,34.39 52.17,38.66 JP4.3 50.88,47.96 v50.85,47.98 | JP5.3 57.89,58.52 55.96,58.52 54.81,57.38 JP6.3 48.18,58.7 46.38,58.7 40.36,52.68 27.08,52.68 24.69,50.29 14.68,50.29 2.95,38.56 2.95,34.67 JP-L1.P$4
SCL  (via drill 0.33)
  Top 0.254: U$18.4 v69.26,31.58 v69.27,31.57
  Bottom 0.254: JP-R.6 67.14,29.45 v69.27,31.57
SCL-TST  (via drill 0.33)
  Top 0.254: U3.19 45.38,13.75 v45.24,13.89 | v68.58,34.8 68.58,33.26 U$18.5
  Bottom 0.254: v45.24,13.89 45.24,12.01 47.8,9.45 55.02,9.45 56.08,8.38 58.14,8.38 61.09,5.44 70.51,5.44 72.67,7.59 72.67,34.26 72.19,34.75 68.63,34.75 v68.58,34.8
SDA  (via drill 0.33)
  Top 0.254: U$18.2 70.56,31.6 v70.59,31.57
  Bottom 0.254: JP-R.7 62.37,27.45 63.88,28.96 67.97,28.96 v70.59,31.57
SDA-TST  (via drill 0.33)
  Top 0.254: U3.26 48.97,8.22 48.97,7.49 48.57,7.09 47.57,7.09 v46.76,7.9 | v69.88,35.48 69.88,33.26 U$18.3
  Bottom 0.254: v46.76,7.9 47.02,7.65 50.11,7.65 50.83,8.36 54.41,8.36 55.6,7.16 57.28,7.16 59.46,4.98 70.89,4.98 73.23,7.32 73.23,34.49 72.24,35.48 v69.88,35.48
SSN  (via drill 0.33)
  Top 0.254: 39.77,27.51 JP-L.7 | v36.65,27.41 39.79,27.41 JP-L.7 | U$18.6 67.96,34.2 v67.39,34.77 | JP-L.7 42.43,27.45 v43.36,26.52
  Bottom 0.254: 3.06,27.45 4.01,26.49 4.01,20.93 18.87,6.07 35.1,6.07 36.09,7.06 36.09,21.21 36.86,21.97 36.86,27.2 v36.65,27.41 | v43.36,26.52 43.36,26.67 44.32,27.64 54.23,27.64 55.58,28.98 55.58,40.95 58.24,43.64 62.81,43.64 63.98,42.47 63.98,38.18 v67.39,34.77
SSN-TEST  (via drill 0.33)
  Top 0.254: J1.1 36.96,22.28 37.77,21.46 37.77,8.51 38.41,7.87 41.2,7.87 42.06,8.74 42.06,11.23 42.47,11.63 42.47,12.73 42.49,12.73 43.1,13.34 43.1,14.66 44.86,16.41 47.85,16.41 48.2,16.76 U3.16 47.9,17.15 v47.12,17.15 | U$18.7 67.34,33.2 v67.34,31.6
  Bottom 0.254: v47.12,17.15 47.12,19.2 44.12,22.12 44.12,26.8 44.53,27.23 54.43,27.23 56.06,28.85 56.06,40.84 58.32,43.1 62.56,43.1 63.53,42.14 63.53,37.39 67.34,33.58 v67.34,31.6
SWITCH-EN  (via drill 0.33)
  Top 0.254: R3.2 56.56,43.08 U$16.P$4 47.7,42.34 v45.52,42.34
  Bottom 0.254: JP-L1.P$11 15.87,5.31 35.18,5.31 36.68,6.78 36.68,21.08 37.41,21.84 37.41,41.4 38.2,42.19 45.39,42.19 v45.52,42.34
SWITCH-GO
  Bottom 0.254: S1.1 85.63,1.49 85.16,1.02 85.13,0.99 11.35,0.99 2.9,9.45 JP-L1.P$16
TX1
  Top 0.254: U$9.4 69.26,22.92 68.68,23.5 66.32,23.5 63.6,26.21 63.6,30.58 62.74,31.45 JP-R.5
VBAT  (via drill 0.33)
  Top 0.254: U3.24 45.66,9.75 v45.21,9.32 | 45.87,46.25 45.87,46.36 | v46.99,45.54 46.28,46.25 46.28,46.36
  Top 0.305: U$6.P$1 44.4,46.36
  Top 0.508: 44.4,46.36 45.87,46.36 46.28,46.36 61.52,46.36 63.73,44.15 63.73,36.14 63.12,35.53 62.01,35.53 JP-R.3
  Bottom 0.254: v45.21,9.32 45.19,9.32 43.1,11.4 43.1,24.61 42.16,25.55 42.16,28.85 46.58,33.27 46.58,40.69 47.4,41.5 47.4,45.16 47.02,45.54 v46.99,45.54
VBAT-EN  (via drill 0.33)
  Top 0.254: R4.2 45.43,44.63 U$6.P$4 44.33,43.97 v41.28,40.92
  Bottom 0.254: JP-L1.P$12 14.83,4.34 35.1,4.34 37.26,6.5 37.26,20.96 37.92,21.62 37.92,22.58 37.95,22.61 37.95,41.25 38.38,41.68 40.51,41.68 v41.28,40.92
VBAT-PLG  (via drill 0.33)
  Top 0.305: U$6.P$3 43.86,44.6 43.64,44.6
  Top 0.508: 43.64,44.6 43,44.02 JP2.2 | v34.72,48.62 34.14,49.2 34.14,53.24 31.95,55.4 27.24,55.4 U$17.+
  Bottom 0.508: v34.72,48.62 36.73,48.62 JP2.2
VCC-AE  (via drill 0.33)
  Top 0.254: U3.25 47.65,8.26 v47.07,8.84 | v60.22,24.44 60.5,24.16 60.5,10.13 57.99,7.62 v57.84,7.62 | v60.3,28.47 60.02,28.47 59.74,28.75 56.72,28.75 56.26,28.3 56.26,28 U$12.P$3
  Bottom 0.254: JP-R.1 61.24,39.45 60.6,38.81 60.6,28.78 v60.3,28.47 60.22,28.4 v60.22,24.44 | v47.07,8.84 54.64,8.84 55.85,7.62 v57.84,7.62
VUSB  (via drill 0.33)
  Top 0.254: U3.23 45.5,10.55 v45.19,10.24 | v45.06,30.63 v42.09,30.63
  Bottom 0.254: v45.19,10.24 45.11,10.24 43.61,11.74 43.61,24.79 42.65,25.76 42.65,28.58 44.7,30.63 v45.06,30.63 | JP-L.1 39.85,39.47 40.46,39.47 41.83,38.1 41.83,30.89 v42.09,30.63
VUSB-EN  (via drill 0.33)
  Top 0.254: v38.68,40.89 38.68,47.9 40.59,49.81 U$1.P$4 | R1.2 41.77,53.67 U$1.P$4 | 40.59,53.78 U$1.P$4
  Bottom 0.254: JP-L1.P$13 13.67,3.51 | 13.67,3.51 13.72,3.45 | v38.68,40.89 38.51,40.72 38.51,21.51 37.77,20.73 37.77,6.12 35.1,3.51 13.67,3.51

### Text on the board
tPlace: LCD | D | T | 16U2 | G | D- | V | D+ | LIGHT | 256RFR2 | Driver Scout | Scout Under Test | SWITCH | BATTERY | 16U2 | 3V3 | 3V3 | VUSB | VUSB | GND | GND | BKPK | BKPK | VBAT | VBAT | RST | RST | RX1 | 256RFR2 | RX1 | SCK | SCK | TX1 | TX1 | MISO | MISO | SCL | SCL | MOSI | MOSI | SDA | SDA | SS | 328P | SS | AREF | AREF | RX0 | RX0 | A0 | A0 | TX0 | TX0 | A1 | A1 | D2 | D2 | A2 | A2 | D3 | D3 | A3 | A3 | D4 | D4 | A4 | A4 | D5 | D5 | A5 | A5 | D6 | D6 | A6 | A6 | D7 | D7 | A7 | A7 | D8 | D8 | Pinoccio Scout v1.0 Test Jig (v1.0)
tDocu: Pinoccio(tm) Scout Test Jig v1.0 | Design by: Eric Jennings for Pinoccio | http://pinocc.io | Licensed under CERN OHL v.1.1